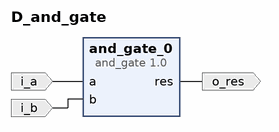
[diagram p0: block diagram of the top level]
# Vivado block design D_and_gate, xczu7ev-ffvf1517-3-e, Vivado 2023.2
create_bd_design D_and_gate

create_bd_port -dir I -type data i_a
create_bd_port -dir I -type data i_b
create_bd_port -dir O -type data o_res

create_bd_cell -type ip -vlnv ci_inovador:logic_gates:and_gate:1.0 and_gate_0

# ---- connections ----

connect_bd_net -net a_0_1 [get_bd_ports i_a] [get_bd_pins and_gate_0/a]
connect_bd_net [get_bd_pins and_gate_0/res] [get_bd_ports o_res]
connect_bd_net -net b_0_1 [get_bd_ports i_b] [get_bd_pins and_gate_0/b]

validate_bd_design
save_bd_design
